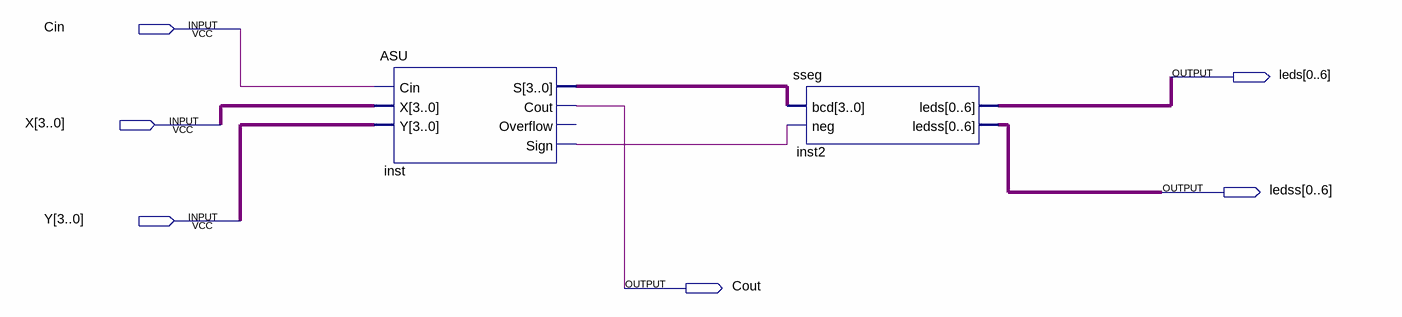
[diagram p0: schematic sheet]
// Quartus schematic CombinedASU.bdf as structural Verilog: 2 symbols, 6 pins
module CombinedASU (
  input  Cin,
  input  [3:0] X,
  input  [3:0] Y,
  output [0:6] leds,
  output [0:6] ledss,
  output Cout
);

  wire inst_sign;
  wire [3:0] inst_s;

  ASU inst (.Cin(Cin), .X(X), .Y(Y), .S(inst_s), .Cout(Cout), .Sign(inst_sign));  // open: Overflow
  sseg inst2 (.bcd(inst_s), .neg(inst_sign), .leds(leds), .ledss(ledss));
endmodule
